# Altium schematic sheet DRIVER.SchDoc
size A4
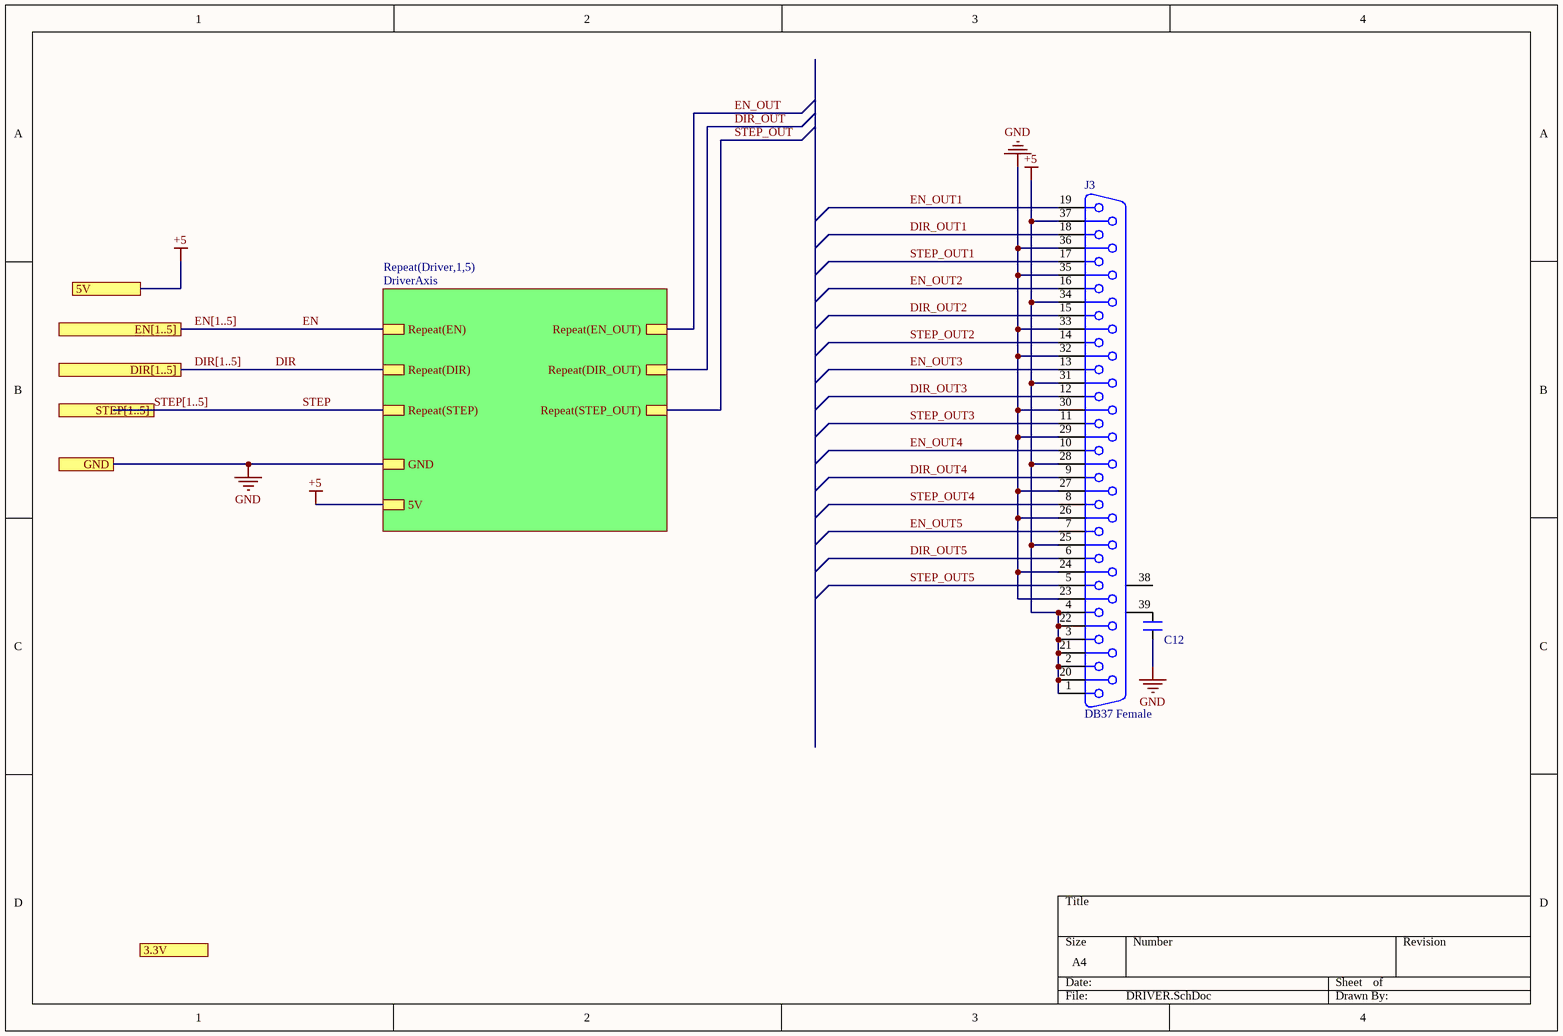
[diagram p0: DRIVER.SchDoc]

## Parts
C12  10uF  [CN-SMD-0603_big]  (value not drawn)
J3  DB37 Female  [DB37]

## Sub-sheets
Repeat(Driver,1,5) = DriverAxis: Repeat(EN), Repeat(DIR), Repeat(STEP), GND, Repeat(EN_OUT), Repeat(DIR_OUT), Repeat(STEP_OUT), 5V

## Ports
3.3V, 5V, DIR[1..5], EN[1..5], GND, STEP[1..5]

## Nets
+5: J3.1 J3.2 J3.3 J3.4 J3.20 J3.21 J3.22 J3.25 J3.28 J3.31 J3.34 J3.37 ; port 5V, sheet Repeat(Driver,1,5)/5V
GND: C12.1 J3.23 J3.24 J3.26 J3.27 J3.29 J3.30 J3.32 J3.33 J3.35 J3.36 ; port GND, sheet Repeat(Driver,1,5)/GND
DIR: sheet Repeat(Driver,1,5)/Repeat(DIR)
DIR_OUT: sheet Repeat(Driver,1,5)/Repeat(DIR_OUT)
DIR_OUT1: J3.18
DIR_OUT2: J3.15
DIR_OUT3: J3.12
DIR_OUT4: J3.9
DIR_OUT5: J3.6
EN: sheet Repeat(Driver,1,5)/Repeat(EN)
EN_OUT: sheet Repeat(Driver,1,5)/Repeat(EN_OUT)
EN_OUT1: J3.19
EN_OUT2: J3.16
EN_OUT3: J3.13
EN_OUT4: J3.10
EN_OUT5: J3.7
STEP: sheet Repeat(Driver,1,5)/Repeat(STEP)
STEP_OUT: sheet Repeat(Driver,1,5)/Repeat(STEP_OUT)
STEP_OUT1: J3.17
STEP_OUT2: J3.14
STEP_OUT3: J3.11
STEP_OUT4: J3.8
STEP_OUT5: J3.5
NetC12_2: C12.2 J3.39(MH2)

Not connected (* = marked no-connect by the designer): J3 38(MH1)

## Buses and harness runs
bus DIR[1..5] = port DIR[1..5]
bus EN[1..5] = port EN[1..5]
bus STEP[1..5] = port STEP[1..5]

## Library data of the parts
C12 = CN: Value: 33pF